# Altium schematic sheet SFR_Ports.SchDoc: LCD Spirit Level Tester
size B; Organization: Altium Limited; Address1: L3, 12a Rodborough Rd; Address2: Frenchs Forest; Address3: NSW; Address4: Australia 2086; DocumentNumber: 3; SheetNumber: 3; SheetTotal: 3
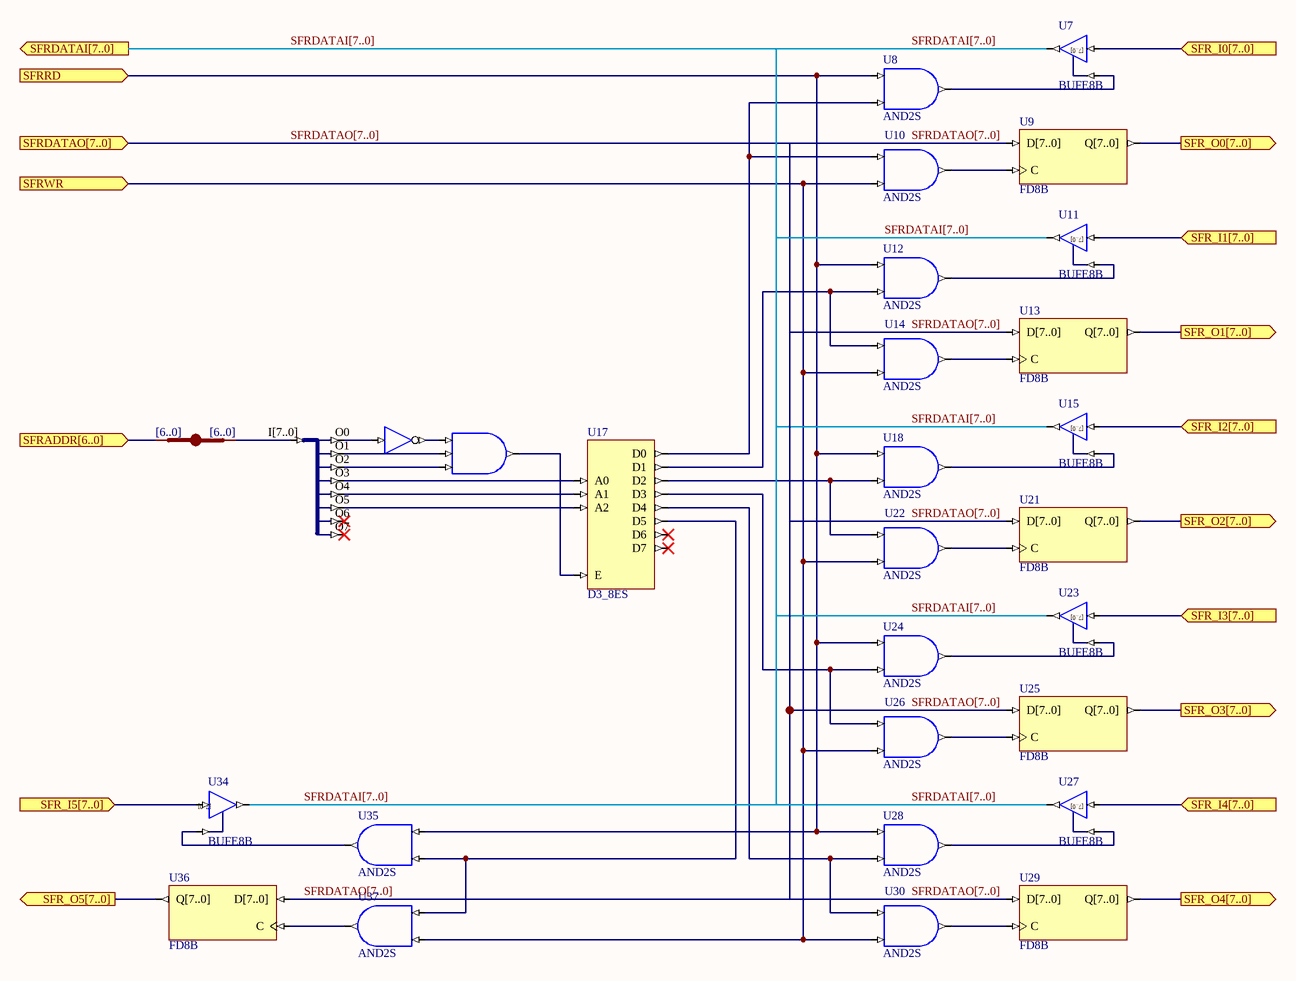
[diagram p0: SFR_Ports.SchDoc]

## Parts
JB_S1  IndexA: [6..0]  (hidden comment: JB)
U7  BUFE8B
U8  AND2S
U9  FD8B
U10  AND2S
U11  BUFE8B
U12  AND2S
U13  FD8B
U14  AND2S
U15  BUFE8B
U16  INV  (value not drawn)
U17  D3_8ES
U18  AND2S
U19  AND3S  (value not drawn)
U20  J8B_8S  (value not drawn)
U21  FD8B
U22  AND2S
U23  BUFE8B
U24  AND2S
U25  FD8B
U26  AND2S
U27  BUFE8B
U28  AND2S
U29  FD8B
U30  AND2S
U34  BUFE8B
U35  AND2S
U36  FD8B
U37  AND2S

## Ports
SFR_I0[7..0] (in), SFR_I1[7..0] (in), SFR_I2[7..0] (in), SFR_I3[7..0] (in), SFR_I4[7..0] (in), SFR_I5[7..0] (in), SFR_O0[7..0] (out), SFR_O1[7..0] (out), SFR_O2[7..0] (out), SFR_O3[7..0] (out), SFR_O4[7..0] (out), SFR_O5[7..0] (out), SFRADDR[6..0] (in), SFRDATAI[7..0] (out), SFRDATAO[7..0] (in), SFRRD (in), SFRWR (in)

## Nets
SFR_I0[7..0]: U7.I[7..0] ; port SFR_I0[7..0]
SFR_I1[7..0]: U11.I[7..0] ; port SFR_I1[7..0]
SFR_I2[7..0]: U15.I[7..0] ; port SFR_I2[7..0]
SFR_I3[7..0]: U23.I[7..0] ; port SFR_I3[7..0]
SFR_I4[7..0]: U27.I[7..0] ; port SFR_I4[7..0]
SFR_I5[7..0]: U34.I[7..0] ; port SFR_I5[7..0]
SFR_O0[7..0]: U9.Q[7..0] ; port SFR_O0[7..0]
SFR_O1[7..0]: U13.Q[7..0] ; port SFR_O1[7..0]
SFR_O2[7..0]: U21.Q[7..0] ; port SFR_O2[7..0]
SFR_O3[7..0]: U25.Q[7..0] ; port SFR_O3[7..0]
SFR_O4[7..0]: U29.Q[7..0] ; port SFR_O4[7..0]
SFR_O5[7..0]: U36.Q[7..0] ; port SFR_O5[7..0]
SFRADDR[6..0]: JB_S1.A[0..0] ; port SFRADDR[6..0]
SFRDATAI[7..0]: U7.O[7..0] U11.O[7..0] U15.O[7..0] U23.O[7..0] U27.O[7..0] U34.O[7..0] ; port SFRDATAI[7..0]
SFRDATAO[7..0]: U9.D[7..0] U13.D[7..0] U21.D[7..0] U25.D[7..0] U29.D[7..0] U36.D[7..0] ; port SFRDATAO[7..0]
SFRRD: U8.I0 U12.I0 U18.I0 U24.I0 U28.I0 U35.I0 ; port SFRRD
SFRWR: U10.I1 U14.I1 U22.I1 U26.I1 U30.I1 U37.I1 ; port SFRWR
NetJB_S1_B[0..0]: JB_S1.B[0..0] U20.I[7..0]
NetU7_E: U7.E U8.O
NetU8_I1: U8.I1 U10.I0 U17.D0
NetU9_C: U9.C U10.O
NetU11_E: U11.E U12.O
NetU12_I1: U12.I1 U14.I0 U17.D1
NetU13_C: U13.C U14.O
NetU15_E: U15.E U18.O
NetU16_I: U16.I U20.O0
NetU16_O: U16.O U19.I0
NetU17_A0: U17.A0 U20.O3
NetU17_A1: U17.A1 U20.O4
NetU17_A2: U17.A2 U20.O5
NetU17_D2: U17.D2 U18.I1 U22.I0
NetU17_D3: U17.D3 U24.I1 U26.I0
NetU17_D4: U17.D4 U28.I1 U30.I0
NetU17_D5: U17.D5 U35.I1 U37.I0
NetU17_E: U17.E U19.O
NetU19_I1: U19.I1 U20.O1
NetU19_I2: U19.I2 U20.O2
NetU21_C: U21.C U22.O
NetU23_E: U23.E U24.O
NetU25_C: U25.C U26.O
NetU27_E: U27.E U28.O
NetU29_C: U29.C U30.O
NetU34_E: U34.E U35.O
NetU36_C: U36.C U37.O

Not connected (* = marked no-connect by the designer): U17 D6* D7*; U20 O6* O7*

## Buses and harness runs
bus SFRDATAI[7..0] = port SFRDATAI[7..0]
bus SFRDATAO[7..0] = port SFRDATAO[7..0]

## Notes on the sheet
- Title
- Size:
- Date:
- B
- Number:
- Time:
- Revision:
- Sheet
- of
- File:
- (in symbol BUFE8B) [7..0]

## Library data of the parts
JB_S1 = JB: System BUS Joiner; Published: 29-Jan-2004; Publisher: Altium Limited; IndexB: [6..0]; FunctionalClass: Bus Joiner; HelpURL: CR0118 FPGA Generic Library Guide.pdf#page=296; LastRevisionNo: 1.00.00
U7 U11 U15 U23 U27 U34 = BUFE8B: 8-Bit 3-state Buffer with Active High Enable, Bus Version; ArchiveName: GENERIC; PortSize: 8; SubClass: BUFE; VHDLIB_SIM: GENERIC_LIB; XilinxEquivalent: BUFE8; Published: 29-Jan-2004; Publisher: Altium Limited; ComponentLink1Description: Core &Resource Usage; ComponentLink1URL: CR0125 FPGA Buffer Resource Usage.pdf#page=41; Enable: High; FunctionalClass: Buffer; HelpURL: CR0118 FPGA Generic Library Guide.pdf#page=123; LastRevisionNo: 1.00.00; PortStyle: Bus Version
U8 U10 U12 U14 U18 U22 U24 U26 U28 U30 U35 U37 = AND2S: 2-Input AND Gate, Single Pin Version; ArchiveName: GENERIC; FunctionalClass: Logic Primitive; PortSize: 2; VHDLIB_SIM: GENERIC_LIB; XilinxEquivalent: AND2; Published: 29-Jan-2004; Publisher: Altium Limited; ComponentLink1Description: Core &Resource Usage; ComponentLink1URL: CR0136 FPGA Logic Primitive Resource Usage.pdf#page=13; HelpURL: CR0118 FPGA Generic Library Guide.pdf#page=113; LastRevisionNo: 1.00.00; PortStyle: Single Pin Version; SubClass: AND
U9 U13 U21 U25 U29 U36 = FD8B: 8-Bit D-Type Flip-Flop, Bus Version; ArchiveName: GENERIC; ClockTrigger: Rising; PortSize: 8; SubClass: FD; VHDLIB_SIM: GENERIC_LIB; XilinxEquivalent: FD8; Published: 29-Jan-2004; Publisher: Altium Limited; ComponentLink1Description: Core &Resource Usage; ComponentLink1URL: CR0133 FPGA Flip Flop Resource Usage.pdf#page=69; FunctionalClass: Flip-Flop; HelpURL: CR0118 FPGA Generic Library Guide.pdf#page=169; LastRevisionNo: 1.00.00; PortStyle: Bus Version
U16 = INV: Inverter; ArchiveName: GENERIC; FunctionalClass: Logic Primitive; VHDLIB_SIM: GENERIC_LIB; Published: 29-Jan-2004; Publisher: Altium Limited; ComponentLink1Description: Core &Resource Usage; ComponentLink1URL: CR0136 FPGA Logic Primitive Resource Usage.pdf#page=61; HelpURL: CR0118 FPGA Generic Library Guide.pdf#page=290; LastRevisionNo: 1.00.00; SubClass: INV; XilinxEquivalent: INV
U17 = D3_8ES: Binary 3- to 8-Bit Decoder with Enable, Single Pin Version; XilinxEquivalent: D3_8E; SubClass: n_m; Enable: High; PortSize: 8; ArchiveName: GENERIC; VHDLIB_SIM: GENERIC_LIB; Published: 29-Jan-2004; Publisher: Altium Limited; LastRevisionNo: 1.00.00; HelpURL: CR0118 FPGA Generic Library Guide.pdf#page=158; ComponentLink1URL: CR0131 FPGA Decoder Resource Usage.pdf#page=8; ComponentLink1Description: Core &Resource Usage; FunctionalClass: Decoder; PortStyle: Single Pin Version
U19 = AND3S: 3-Input AND Gate, Single Pin Version; ArchiveName: GENERIC; FunctionalClass: Logic Primitive; PortSize: 3; VHDLIB_SIM: GENERIC_LIB; XilinxEquivalent: AND3; Published: 29-Jan-2004; Publisher: Altium Limited; ComponentLink1Description: Core &Resource Usage; ComponentLink1URL: CR0136 FPGA Logic Primitive Resource Usage.pdf#page=23; HelpURL: CR0118 FPGA Generic Library Guide.pdf#page=113; LastRevisionNo: 1.00.00; PortStyle: Single Pin Version; SubClass: AND
U20 = J8B_8S: 8-Bit input bus to 8 single pin outputs; ArchiveName: GENERIC; FunctionalClass: Bus Joiner; PortSize: 8; VHDLIB_SIM: GENERIC_LIB; Published: 29-Jan-2004; Publisher: Altium Limited; ComponentLink1Description: Core &Resource Usage; ComponentLink1URL: CR0126 FPGA Bus Joiner Resource Usage.pdf#page=27; HelpURL: CR0118 FPGA Generic Library Guide.pdf#page=303; LastRevisionNo: 1.00.00